# EAGLE design dual-switch (EAGLE 5.07)
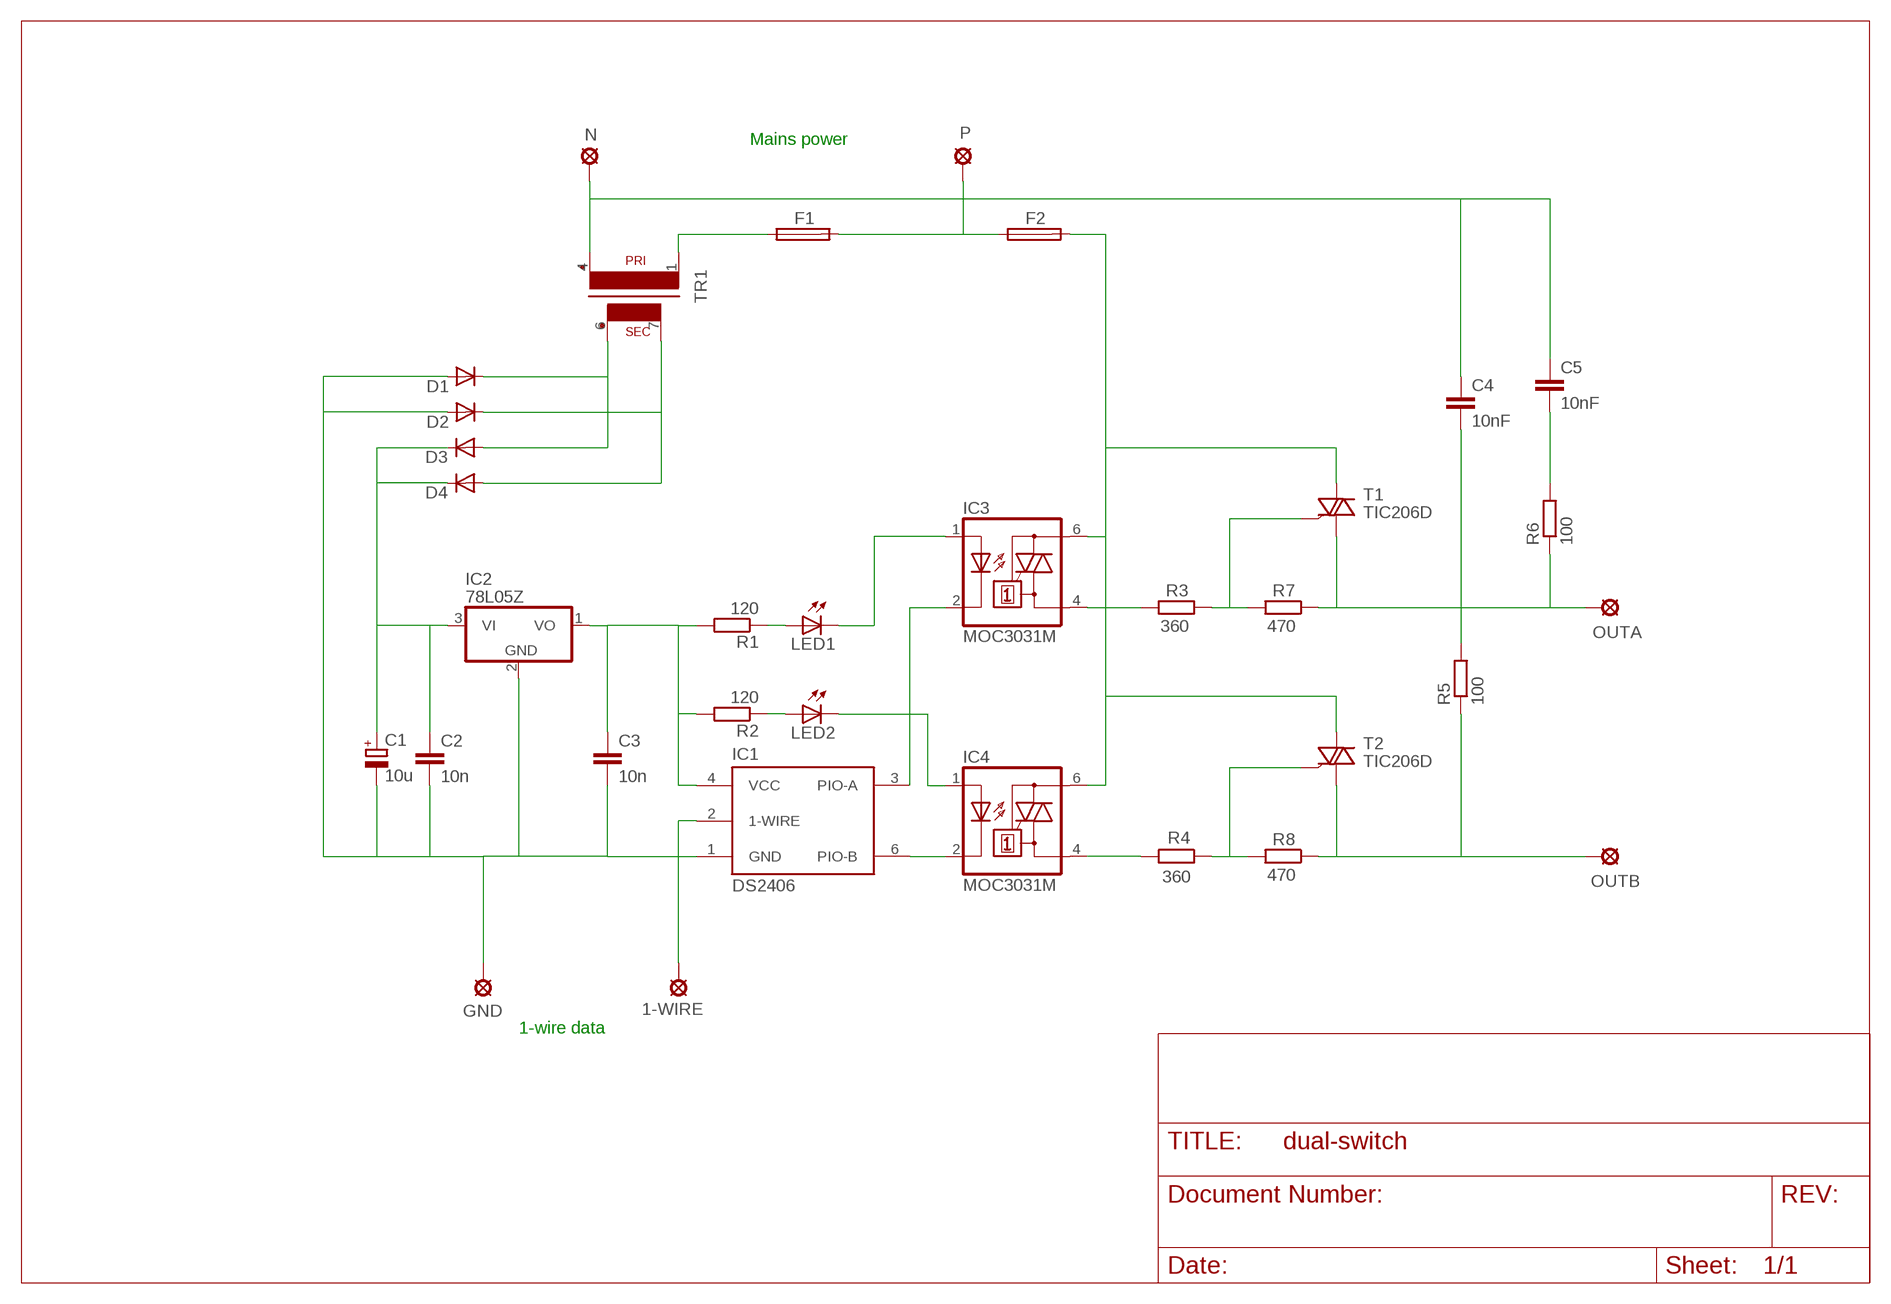
[diagram p0: schematic, sheet 1]

## Parts
1-WIRE  SE14  [SE14]
C1  10u  CPOL-EUE2.5-6  [E2,5-6]
C2  10n  C-EU025-025X050  [C025-025X050]
C3  10n  C-EU025-025X050  [C025-025X050]
C4  10nF  C10/5  [C10B5]
C5  10nF  C10/5  [C10B5]
D1  1N4004  [DO41-10]
D2  1N4004  [DO41-10]
D3  1N4004  [DO41-10]
D4  1N4004  [DO41-10]
F1  FUSESHK20L  [SHK20L]
F2  FUSESHK20L  [SHK20L]
GND  SE14  [SE14]
IC1  DS2406  [TSOC6]
IC2  78L05Z  [TO92]
IC3  MOC3031M  [DIL06]
IC4  MOC3031M  [DIL06]
LED1  LED5MM  [LED5MM]
LED2  LED5MM  [LED5MM]
N  SE14  [SE14]
OUTA  SE14  [SE14]
OUTB  SE14  [SE14]
P  SE14  [SE14]
R1  120  R-EU_0207/10  [0207/10]
R2  120  R-EU_0207/10  [0207/10]
R3  360  R-EU_0207/10  [0207/10]
R4  360  R-EU_0207/10  [0207/10]
R5  100  R-EU_0207/10  [0207/10]
R6  100  R-EU_0207/10  [0207/10]
R7  470  R-EU_0207/10  [0207/10]
R8  470  R-EU_0207/10  [0207/10]
T1  TIC206D  [TO220BV]
T2  TIC206D  [TO220BV]
TR1  EE20-1  [EE20-1]

## Nets
N$1: 1-WIRE.MP IC1.2(1-WIRE)
N$2: D1.C D3.A TR1.6(S3)
N$3: IC3.1(A) LED1.K(C)
N$4: IC4.1(A) LED2.K(C)
N$5: F2.2A IC3.6(A2) IC4.6(A2) T1.T2(A2) T2.T2(A2)
N$6: C1.+ C2.1 D3.C D4.C IC2.3(VI)
N$7: IC1.6(PIO-B) IC4.2(C)
N$8: C4.1 C5.1 N.MP TR1.4(P2)
N$9: R3.1 R7.2 T1.G
N$10: LED2.A R2.1
N$11: C1.- C2.2 C3.2 D1.A D2.A GND.MP IC1.1(GND) IC2.2(GND)
N$12: D2.C D4.A TR1.7(S4)
N$13: C3.1 IC1.4(VCC) IC2.1(VO) R1.2 R2.2
N$14: IC1.3(PIO-A) IC3.2(C)
N$15: R4.1 R8.2 T2.G
N$16: C4.2 R5.2
N$17: OUTA.MP R6.1 R7.1 T1.T1(A1)
N$18: OUTB.MP R5.1 R8.1 T2.T1(A1)
N$19: IC3.4(A1) R3.2
N$20: LED1.A R1.1
N$21: IC4.4(A1) R4.2
N$23: F1.1A TR1.1
N$24: C5.2 R6.2
N$25: F1.2A F2.1A P.MP

## Notes on the sheet
- Mains power
- 1-wire data

## Library data of the parts
1-WIRE GND N OUTA OUTB P = solpad:SE14: SOLDER PAD E1553, drill 1,4mm, distributor Buerklin, 07F820
C1 = rcl:CPOL-EU: POLARIZED CAPACITOR, European symbol
C2 C3 = rcl:C-EU: CAPACITOR, European symbol
C4 C5 = capacitor-wima:C: CAPACITOR naming: grid - package width
D1-D4 = diode:1N4004: DIODE general purpose rectifier, 1 A
F1 F2 = fuse:FUSE: Fuse
IC1 = maxim:DS2406
IC2 = linear:78*: Positive VOLTAGE REGULATOR Source: http://cache.national.com/ds/LM/LM78L05.pdf http://www.fairchildsemi.com/ds/LM/LM7805.pdf
IC3 IC4 = optocoupler:MOC30*: 6-Pin DIP Zero-Cross Optoisolators Triac Driver Output (250/400 Volt Peak) Source: http://www.fairchildsemi.com/ds/MO/MOC3043-M.pdf
LED1 LED2 = led:LED: LED OSRAM: - CHIPLED LG R971, LG N971, LY N971, LG Q971, LY Q971, LO R971, LY R971 LH N974, LH R974 LS Q976, LO Q976, LY Q976 LO Q996 - Hyper CHIPLED LW Q18S LB Q993, LB Q99A, LB R99A - SideLED LS A670, LO A670, LY A670, LG A670, LP A670 LB A673, LV A673, LT A673, LW A673 LH A674 LY A675 LS A676, LA A676, LO A676, LY A676, LW A676 LS A679, LY A679, LG A679 - Hyper Micro SIDELED® LS Y876, LA Y876, LO Y876, LY Y876 LT Y87S - SmartLED LW L88C, LW L88S LB L89C, LB L89S, LG L890 LS L89K, LO L89K, LY L89K LS L896, LA L896, LO L896, LY L896 - TOPLED LS T670, LO T670, LY T670, LG T670, LP T670 LSG T670, LSP T670, LSY T670, LOP T670, LYG T670 LG T671, LOG T671, LSG T671 LB T673, LV T673, LT T673, LW T673 LH T674 LS T676, LA T676, LO T676, LY T676, LB T676, LH T676, LSB T676, LW T676 LB T67C, LV T67C, LT T67C, LS T67K, LO T67K, LY T67K, LW E67C LS E67B, LA E67B, LO E67B, LY E67B, LB E67C, LV E67C, LT E67C LW T67C LS T679, LY T679, LG T679 LS T770, LO T770, LY T770, LG T770, LP T770 LB T773, LV T773, LT T773, LW T773 LH T774 LS E675, LA E675, LY E675, LS T675 LS T776, LA T776, LO T776, LY T776, LB T776 LHGB T686 LT T68C, LB T68C - Hyper Mini TOPLED® LB M676 - Mini TOPLED Santana® LG M470 LS M47K, LO M47K, LY M47K Source: http://www.osram.convergy.de LUXEON: - LUMILED® LXK2-PW12-R00, LXK2-PW12-S00, LXK2-PW14-U00, LXK2-PW14-V00 LXK2-PM12-R00, LXK2-PM12-S00, LXK2-PM14-U00 LXK2-PE12-Q00, LXK2-PE12-R00, LXK2-PE12-S00, LXK2-PE14-T00, LXK2-PE14-U00 LXK2-PB12-K00, LXK2-PB12-L00, LXK2-PB12-M00, LXK2-PB14-N00, LXK2-PB14-P00, LXK2-PB14-Q00 LXK2-PR12-L00, LXK2-PR12-M00, LXK2-PR14-Q00, LXK2-PR14-R00 LXK2-PD12-Q00, LXK2-PD12-R00, LXK2-PD12-S00 LXK2-PH12-R00, LXK2-PH12-S00 LXK2-PL12-P00, LXK2-PL12-Q00, LXK2-PL12-R00 Source: www.luxeon.com KINGBRIGHT: KA-3528ASYC Source: www.kingbright.com
R1-R8 = resistor:R-EU_: RESISTOR, European symbol
T1 T2 = triac:TIC206: TRIAC Source: http://www.bourns.com/pdfs/tic206.pdf
TR1 = trafo:EE20-1: TRANSFORMER 1 primary winding, 1 secondary winding ERA

## Board
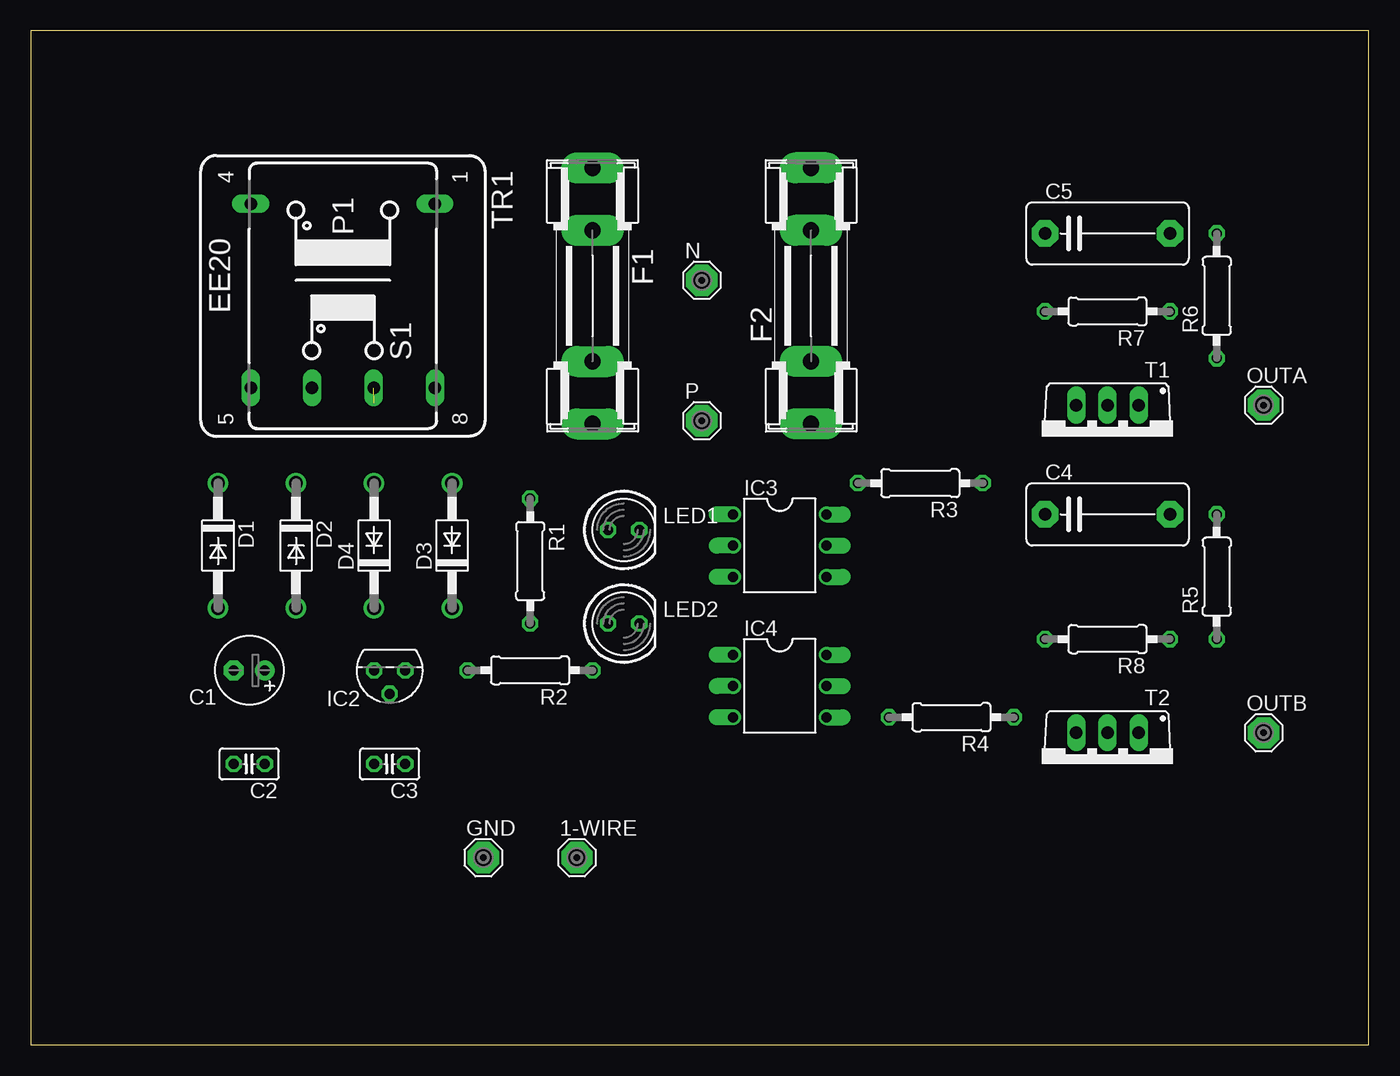
[diagram p1: board, top side]
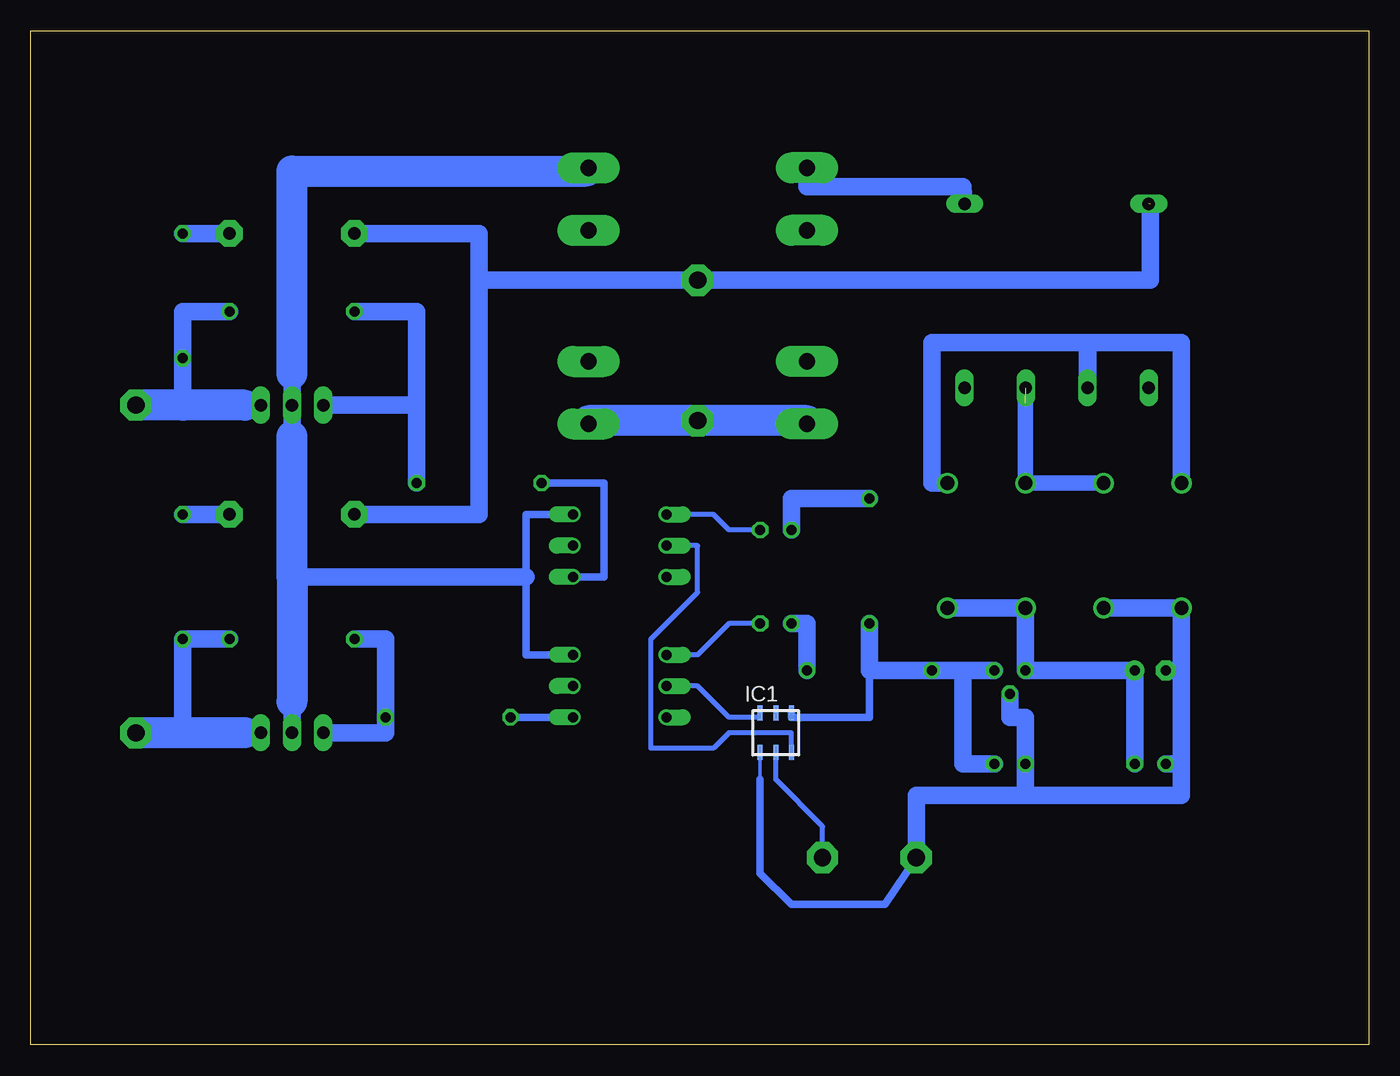
[diagram p2: board, bottom side, seen from below]

Size 108.89 x 82.54 mm. Coordinates in mm from the lower left corner, seen from the top.
Outline: 0,0 108.89,0 108.89,82.54 0,82.54 0,0
Copper layers (1*16): Top 0.035mm / dielectric 1.5mm / Bottom 0.035mm
Design rules "default *": minimum track width 10mil, minimum drill 24mil, track to track 10mil, track to pad 10mil, pad to pad 10mil, via to via 10mil, smd to smd 8mil, copper to edge 40mil, drill to drill 8mil, minimum pad ring 10mil, minimum via ring 8mil, stop-mask expansion 4mil, vias tented up to drill 0mil, thermal gap 10mil

### Footprints (pad centres in the part's own frame; a part is rotated, then mirrored left to right if it is on the bottom)
SE14 = drill 1.397 pad 2.54 octagon: MP 0,0
E2,5-6 = drill 0.813 pad 1.6 round: + -1.27,0 | drill 0.813 pad 1.6 octagon: - 1.27,0
C025-025X050 = drill 0.813 octagon: 1 -1.27,0; 2 1.27,0
C10B5 = drill 1.016 pad 2.159 octagon: 1 -5.08,0; 2 5.08,0
DO41-10 = drill 1.118 round: A 5.08,0; C -5.08,0
SHK20L = drill 1.321 pad 2.54 long: 1A -10.414,0; 1B -5.334,0; 2A 10.414,0; 2B 5.334,0
TSOC6 = smd 0.406 x 1.219: 1 -1.27,-1.6; 2 0,-1.6; 3 1.27,-1.6; 4 1.27,1.6; 5 0,1.6; 6 -1.27,1.6
TO92 = drill 0.813 octagon: 1 -1.27,0; 2 0,1.905; 3 1.27,0
DIL06 = drill 0.813 offset: 1 -2.54,-3.81; 2 0,-3.81; 3 2.54,-3.81; 4 2.54,3.81; 5 0,3.81; 6 -2.54,3.81
LED5MM = drill 0.813 octagon: A -1.27,0; K 1.27,0
0207/10 = drill 0.813 octagon: 1 -5.08,0; 2 5.08,0
TO220BV = drill 1.016 long: G 2.54,-2.54; T1 -2.54,-2.54; T2 0,-2.54
EE20-1 = drill 1.016 long: 1 -7.493,7.493; 4 -7.493,-7.493; 5 7.493,-7.493; 6 7.493,-2.515; 7 7.493,2.515; 8 7.493,7.493

### Placement (x,y rotation side)
1-WIRE  44.45,15.24 0 top
C1  17.78,30.48 180 top
C2  17.78,22.86 180 top
C3  29.21,22.86 180 top
C4  87.63,43.18 0 top
C5  87.63,66.04 0 top
D1  15.24,40.64 270 top
D2  21.59,40.64 270 top
D3  34.29,40.64 90 top
D4  27.94,40.64 90 top
F1  45.72,60.96 270 top
F2  63.5,60.96 90 top
GND  36.83,15.24 0 top
IC1  48.26,25.4 0 bottom
IC2  29.21,30.48 180 top
IC3  60.96,40.64 270 top
IC4  60.96,29.21 270 top
LED1  48.26,41.91 0 top
LED2  48.26,34.29 0 top
N  54.61,62.23 0 top
OUTA  100.33,52.07 0 top
OUTB  100.33,25.4 0 top
P  54.61,50.8 0 top
R1  40.64,39.37 270 top
R2  40.64,30.48 180 top
R3  72.39,45.72 180 top
R4  74.93,26.67 180 top
R5  96.52,38.1 90 top
R6  96.52,60.96 90 top
R7  87.63,59.69 180 top
R8  87.63,33.02 180 top
T1  87.63,49.53 180 top
T2  87.63,22.86 180 top
TR1  25.4,60.96 270 top

### Tracks (layer width: path | path; a pad name or v marks a point on that pad's centre or on a via)
N$1
  Bottom 0.406: 1-WIRE.MP 44.45,17.78 48.26,21.59 IC1.2
N$2
  Bottom 1.422: D1.C 15.24,57.15 22.86,57.15 | 22.86,57.15 22.89,57.15 | 22.89,57.15 TR1.6 22.86,53.47 22.86,57.15 | 22.89,57.15 35.56,57.15 35.56,45.72 D3.A
N$3
  Bottom 0.406: IC3.1 53.34,43.18 52.07,41.91 LED1.K
N$4
  Bottom 0.406: IC4.1 54.61,31.75 52.07,34.29 LED2.K
N$5
  Bottom 0.61: IC3.6 68.58,43.18 68.58,38.1 68.58,31.75 IC4.6
  Bottom 1.422: 87.63,27.94 T2.T2 | 87.63,49.53 T1.T2 87.63,54.61 | 68.58,38.1 87.63,38.1
  Bottom 2.54: F2.2A arc90 63.75,71.12 87.63,71.12 87.63,54.61 | 87.63,27.94 87.63,38.1 87.63,49.53
N$6
  Bottom 1.422: C2.1 C1.+ IC2.3 D4.C D3.C
N$7
  Bottom 0.406: IC4.2 54.61,29.21 52.07,26.67 49.53,26.67 IC1.6
N$8  (1 unrouted)
  Bottom 1.422: 17.78,68.43 17.78,62.23 N.MP 72.39,62.23 | C4.1 72.39,43.18 72.39,62.23 | C5.1 72.39,66.04 72.39,62.23
N$9
  Bottom 1.422: R7.2 77.47,59.69 77.47,52.07 | R3.1 77.47,52.07 | 77.47,52.07 T1.G
N$10
  Bottom 1.422: R2.1 45.72,34.29 LED2.A
N$11
  Bottom 0.305: 49.53,21.59 IC1.1
  Bottom 0.61: GND.MP 39.37,11.43 46.99,11.43 49.53,13.97 49.53,21.59
  Bottom 1.422: 15.24,22.86 15.24,30.48 | 15.24,22.86 C2.2 | 15.24,30.48 D1.A D2.A | 15.24,30.48 C1.- | 27.94,20.32 C3.2 27.94,26.67 29.21,26.67 IC2.2 | 27.94,20.32 15.24,20.32 15.24,22.86 | 27.94,20.32 36.83,20.32 GND.MP
N$12  (1 unrouted)
  Bottom 1.27: 27.94,52.22 D4.A D2.C
N$13
  Bottom 0.61: 40.64,30.48 40.64,26.67 46.99,26.67 IC1.4
  Bottom 1.422: 33.02,30.48 IC2.1 | 33.02,30.48 33.02,22.86 C3.1 | 33.02,30.48 R2.2 40.64,30.48 R1.2
N$14
  Bottom 0.406: IC1.3 46.99,25.4 52.07,25.4 53.34,24.13 58.42,24.13 58.42,33.02 54.61,36.83 54.61,40.64 IC3.2
N$15
  Bottom 1.422: R8.2 80.01,33.02 R4.1 80.01,25.4 T2.G
N$16
  Bottom 1.422: C4.2 R5.2
N$17
  Bottom 1.422: T1.T1 91.44,52.07 | 96.52,52.07 R6.1 96.52,59.69 R7.1
  Bottom 2.54: 91.44,52.07 96.52,52.07 OUTA.MP
N$18
  Bottom 1.422: T2.T1 91.44,25.4 | R8.1 R5.1 96.52,25.4
  Bottom 2.54: 91.44,25.4 96.52,25.4 OUTB.MP
N$19
  Bottom 0.61: IC3.4 62.23,38.1 62.23,45.72 R3.2
N$20
  Bottom 1.422: R1.1 46.99,44.45 LED1.A
N$21
  Bottom 0.61: IC4.4 R4.2
N$23
  Bottom 1.422: TR1.1 33.02,69.72 33.02,69.85 45.72,69.85 F1.1A
N$24
  Bottom 1.422: C5.2 R6.2
N$25
  Bottom 2.54: F1.2A 45.72,50.8 P.MP 63.5,50.8 F2.1A